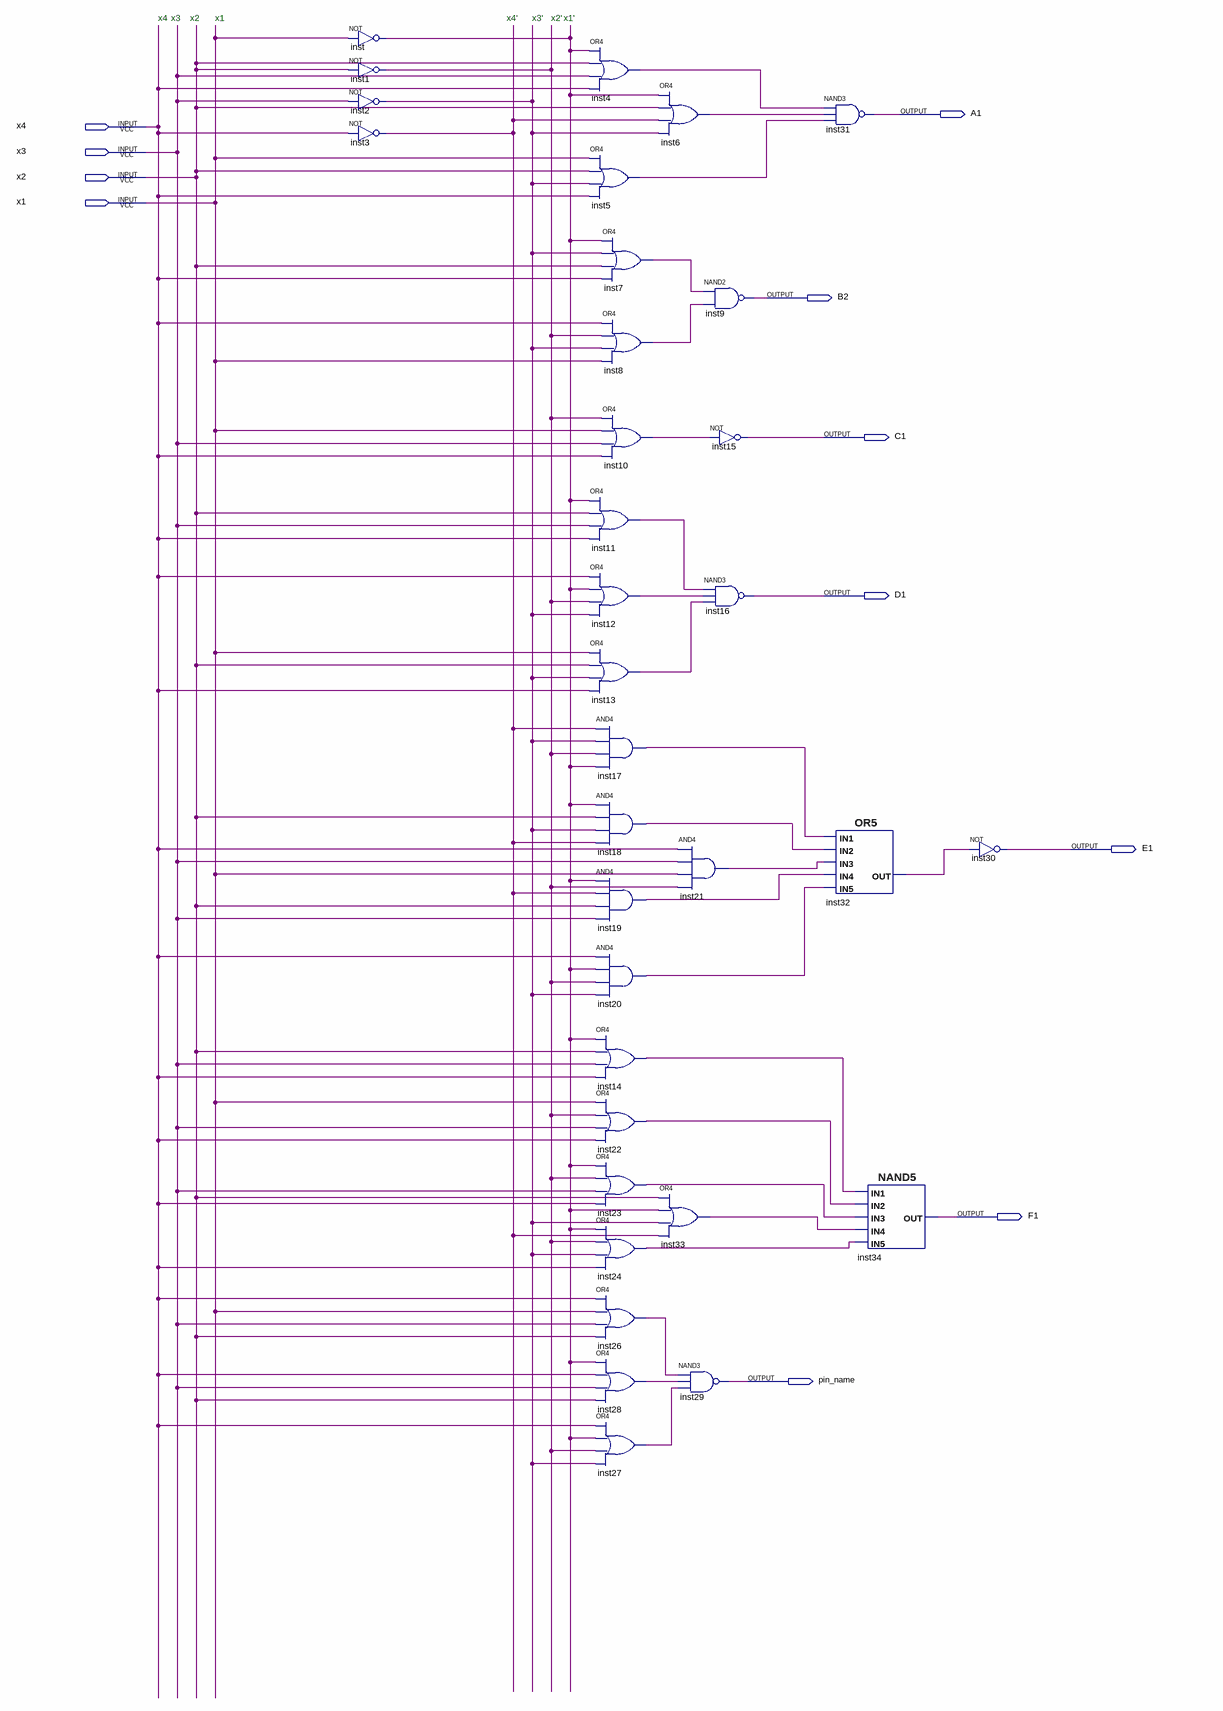
[diagram p0: schematic sheet]
// Quartus schematic indicator1.bdf as structural Verilog: 34 symbols, 11 pins
module indicator1 (
  input  x4,
  input  x3,
  input  x2,
  input  x1,
  output A1,
  output B2,
  output C1,
  output D1,
  output E1,
  output F1,
  output pin_name
);

  wire inst1_out, inst2_out, inst3_out, inst4_out, inst5_out, inst6_out, inst7_out, inst8_out, inst10_out,
       inst11_out, inst12_out, inst13_out, inst14_out, inst17_out, inst18_out, inst19_out, inst20_out,
       inst21_out, inst22_out, inst23_out, inst24_out, inst26_out, inst27_out, inst28_out, inst32_out,
       inst33_out, inst_out;

  not inst (inst_out, x1);
  not inst1 (inst1_out, x2);
  not inst2 (inst2_out, x3);
  not inst3 (inst3_out, x4);
  or inst4 (inst4_out, inst_out, x2, x3, x4);
  or inst5 (inst5_out, x1, x2, inst2_out, x4);
  or inst7 (inst7_out, inst_out, inst2_out, x2, x4);
  or inst8 (inst8_out, x4, inst1_out, inst2_out, x1);
  or inst10 (inst10_out, inst1_out, x1, x3, x4);
  or inst11 (inst11_out, inst_out, x2, x3, x4);
  or inst12 (inst12_out, x4, inst_out, inst1_out, inst2_out);
  or inst13 (inst13_out, x1, x2, inst2_out, x4);
  and inst17 (inst17_out, inst3_out, inst2_out, inst1_out, inst_out);
  and inst18 (inst18_out, inst_out, x2, inst2_out, inst3_out);
  and inst19 (inst19_out, inst_out, inst3_out, x2, x3);
  and inst20 (inst20_out, x4, inst_out, inst1_out, inst2_out);
  or inst14 (inst14_out, inst_out, x2, x3, x4);
  or inst22 (inst22_out, x1, inst1_out, x3, x4);
  or inst23 (inst23_out, inst_out, inst1_out, x3, x4);
  or inst24 (inst24_out, inst_out, inst1_out, inst2_out, x4);
  or inst26 (inst26_out, x4, x1, x3, x2);
  or inst28 (inst28_out, inst_out, x4, x3, x2);
  or inst27 (inst27_out, x4, inst_out, inst1_out, inst2_out);
  or inst6 (inst6_out, inst_out, x2, inst3_out, inst2_out);
  and inst21 (inst21_out, x4, x3, x1, inst1_out);
  or inst33 (inst33_out, x2, inst_out, inst2_out, inst3_out);
  nand inst29 (pin_name, inst26_out, inst28_out, inst27_out);
  nand inst9 (B2, inst7_out, inst8_out);
  not inst15 (C1, inst10_out);
  nand inst16 (D1, inst11_out, inst12_out, inst13_out);
  nand inst31 (A1, inst4_out, inst6_out, inst5_out);
  or inst32 (inst32_out, inst17_out, inst18_out, inst21_out, inst19_out, inst20_out);
  nand inst34 (F1, inst14_out, inst22_out, inst23_out, inst33_out, inst24_out);
  not inst30 (E1, inst32_out);

  // Notes on the sheet:
  //   x4
  //   x3
  //   x2
  //   x1
  //   x4'
  //   x3'
  //   x2'
  //   x1'
endmodule
